# EAGLE design board (EAGLE 9.6.2)
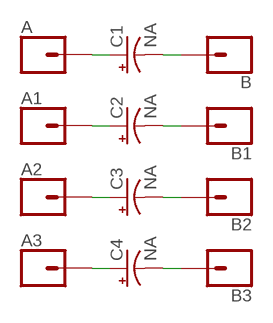
[diagram p0: schematic, sheet 1]

## Parts
A  CONN_01  [1X01]
A1  CONN_01  [1X01]
A2  CONN_01  [1X01]
A3  CONN_01  [1X01]
B  CONN_01  [1X01]
B1  CONN_01  [1X01]
B2  CONN_01  [1X01]
B3  CONN_01  [1X01]
C1  NA  10UF-POLAR-RADIAL-2.5MM-25V-20%  [CPOL-RADIAL-2.5MM-5MM]
C2  NA  10UF-POLAR-RADIAL-2.5MM-25V-20%  [CPOL-RADIAL-2.5MM-5MM]
C3  NA  10UF-POLAR-RADIAL-2.5MM-25V-20%  [CPOL-RADIAL-2.5MM-5MM]
C4  NA  10UF-POLAR-RADIAL-2.5MM-25V-20%  [CPOL-RADIAL-2.5MM-5MM]

## Nets
N$1: A.1 C1.1(+)
N$2: A1.1 C2.1(+)
N$3: A2.1 C3.1(+)
N$4: A3.1 C4.1(+)
N$5: B3.1 C4.2(-)
N$6: B2.1 C3.2(-)
N$7: B1.1 C2.2(-)
N$8: B.1 C1.2(-)

## Library data of the parts
A A1-A3 B B1-B3 = SparkFun-Connectors:CONN_01: Single connection point. Often used as Generic Header-pin footprint for 0.1 inch spaced/style header connections On any of the 0.1 inch spaced packages, you can populate with these: Break Away Headers - Straight <https://www.sparkfun.com/products/116> (PRT-00116) Break Away Male Headers - Right Angle <https://www.sparkfun.com/products/553> (PRT-00553) Female Headers <https://www.sparkfun.com/products/115> (PRT-00115) Break Away Headers - Machine Pin <https://www.sparkfun.com/products/117> (PRT-00117) Break Away Female Headers - Swiss Machine Pin <https://www.sparkfun.com/products/743> (PRT-00743) This device is also useful as a general connection point to wire up your design to another part of your project. Our various solder wires solder well into these plated through hole pads. Hook-Up Wire - Assortment (Stranded, 22 AWG) <https://www.sparkfun.com/products/11375> (PRT-11375) Hook-Up Wire - Assortment (Solid Core, 22 AWG) <https://www.sparkfun.com/products/11367> (PRT-11367) View the entire wire category on our website here <https://www.sparkfun.com/categories/141> Special notes: SMTSO-256-ET is a "flush mount" nut for a 4-40 screw. We mostly use this on specialty testbeds; it is a nice way to connect hardware to your PCB at an adjustable hieght. Also note, the SNAP packages are for using a snappable style connector. We sell a baggie of snaps and they are also used on two LilyPad designs: Snap Assortment - 30 pack (male and female) <https://www.sparkfun.com/products/11347> (DEV-11347) LilyPad Arduino SimpleSnap <https://www.sparkfun.com/products/10941> (DEV-10941) LilyPad SimpleSnap Protoboard <https://www.sparkfun.com/products/10940> (DEV-10940)
C1-C4 = SparkFun-Capacitors:10UF-POLAR: 10.0µF polarized capacitors A capacitor is a passive two-terminal electrical component used to store electrical energy temporarily in an electric field.; PROD_ID: CAP-08440; VALUE: 10uF

## Board
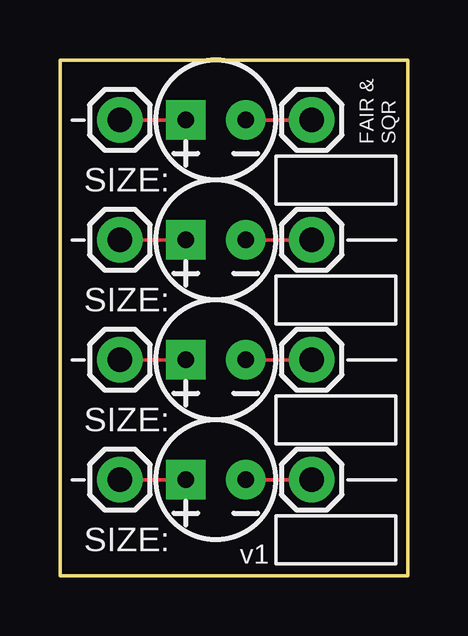
[diagram p1: board, top side]

Size 14.5 x 21.5 mm. Coordinates in mm from the lower left corner, seen from the top.
Outline: 0,0 0,21.5 14.5,21.5 14.5,0 0,0
Copper layers (1*16): Top 0.035mm / dielectric 1.5mm / Bottom 0.035mm
Design rules "default": minimum track width 6mil, minimum drill 0.35mm, track to track 6mil, track to pad 6mil, pad to pad 6mil, via to via 6mil, smd to smd 6mil, copper to edge 40mil, drill to drill 6mil, minimum pad ring 10mil, minimum via ring 8mil, stop-mask expansion 4mil, vias tented up to drill 0mil, thermal gap 10mil

### Footprints (pad centres in the part's own frame; a part is rotated, then mirrored left to right if it is on the bottom)
1X01 = drill 1.016 pad 1.88: 1 0,0
CPOL-RADIAL-2.5MM-5MM = drill 0.7 pad 1.651 square: 1 1.25,0 | drill 0.7 pad 1.651: 2 -1.25,0

### Placement (x,y rotation side)
A  2.5,9 0 top
A1  2.5,19 0 top
A2  2.5,14 0 top
A3  2.5,4 0 top
B  10.5,9 0 top
B1  10.5,19 0 top
B2  10.5,14 0 top
B3  10.5,4 0 top
C1  6.5,9 180 top
C2  6.5,19 180 top
C3  6.5,14 180 top
C4  6.5,4 180 top

### Tracks (layer width: path | path; a pad name or v marks a point on that pad's centre or on a via)
N$1
  Top 0.152: A.1 C1.1
N$2
  Top 0.152: A1.1 C2.1
N$3
  Top 0.152: A2.1 C3.1
N$4
  Top 0.152: A3.1 C4.1
N$5
  Top 0.152: C4.2 B3.1
N$6
  Top 0.152: C3.2 B2.1
N$7
  Top 0.152: C2.2 B1.1
N$8
  Top 0.152: C1.2 B.1

### Text on the board
tPlace: FAIR & / SQR | SIZE: | SIZE: | SIZE: | SIZE: | v1